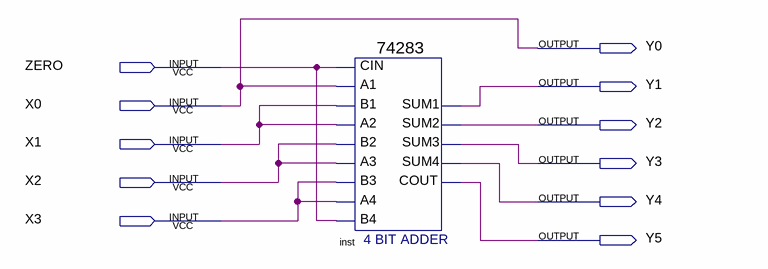
[diagram p0: schematic sheet]
// Quartus schematic hw3-4.bdf as structural Verilog: 1 symbols, 11 pins
module \hw3-4  (
  input  ZERO,
  input  X0,
  input  X1,
  input  X2,
  input  X3,
  output Y0,
  output Y1,
  output Y2,
  output Y3,
  output Y4,
  output Y5
);

  \74283  inst (
    .CIN(ZERO), .A1(X0), .A2(X1), .B2(X2), .A3(X2), .A4(X3), .B4(ZERO), .B1(X1), .B3(X3), .SUM4(Y4),
    .COUT(Y5), .SUM1(Y1), .SUM2(Y2), .SUM3(Y3));

  assign Y0 = X0;
endmodule
